# Altium schematic sheet 5V_to_3V3_LDO.SchDoc
size A; SheetNumber: 1; SheetTotal: 1
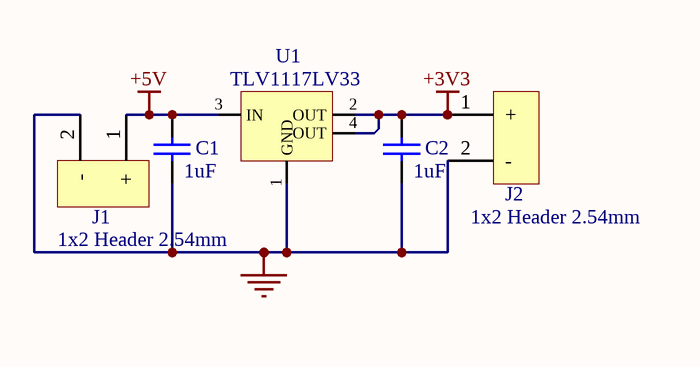
[diagram p0: 5V_to_3V3_LDO.SchDoc]

## Parts
C1  1uF  [C0805]
C2  1uF  [C0805]
J1  1x2 Header 2.54mm  [PINHDR_1x02_P2.54_VERT]
J2  1x2 Header 2.54mm  [PINHDR_1x02_P2.54_VERT]
U1  TLV1117LV33  [TLV1117LV33DCYT]

## Nets
+3V3: C2.2 J2.1(+) U1.2(OUT) U1.4(OUT)
+5V: C1.2 J1.1(+) U1.3(IN)
GND: C1.1 C2.1 J1.2(-) J2.2(-) U1.1(GND)

## Library data of the parts
C1 C2 = CAP_C0805: Ceramic Capacitor, 0805 (2012 Metric); Dielectric: X7R; Voltage Rating: 10V; Published: 8-Jun-2000; LatestRevisionDate: 17-Jul-2002; LatestRevisionNote: Re-released for DXP Platform.; PackageReference: RAD-0.3; Publisher: Altium Limited; PackageDescription: Radial Cap, Thru-Hole; 2 Leads; 0.3 in Pin Spacing; Value: 1uF
J1 J2 = 61300211121: 2-pin vertical male header, 2.54mm pitch, through-hole; Manufacturer: Wurth Elektronik; Number of Contacts: 2; Manufacturer Part Number: 61300211121; RoHS: Compliant; Gender: Male; Mounting Technology: Through Hole; Pins: 2; Number of Rows: 1; Orientation: Vertical; Pitch: 2.54mm; ComponentLink2URL: https://www.we-online.com/components/products/datasheet/61300211121.pdf; ComponentLink2Description: Datasheet
U1 = TLV1117LV33: 1-A, 3.3-V Fixed-Output LDO Regulator